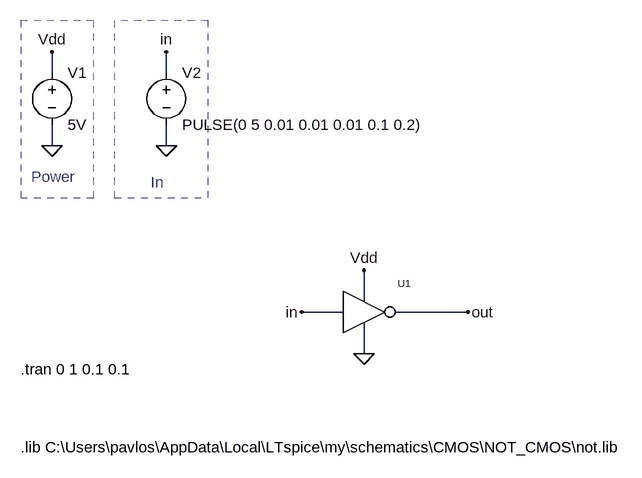
[diagram p0: schematic not_block.asc]
not_block.asc, the LTspice schematic file:
Version 4
SHEET 1 880 680
WIRE -560 -416 -560 -448
WIRE -384 -416 -384 -448
WIRE -560 -304 -560 -336
WIRE -384 -304 -384 -336
WIRE -80 -64 -80 -112
WIRE -112 -48 -176 -48
WIRE 80 -48 -32 -48
WIRE -80 16 -80 -32
FLAG 80 -48 out
FLAG -176 -48 in
FLAG -80 -112 Vdd
FLAG -80 16 0
FLAG -560 -304 0
FLAG -560 -448 Vdd
FLAG -384 -304 0
FLAG -384 -448 in
SYMBOL not -112 -16 R0
SYMATTR InstName U1
SYMBOL voltage -560 -432 R0
WINDOW 123 0 0 Left 0
WINDOW 39 0 0 Left 0
SYMATTR InstName V1
SYMATTR Value 5V
SYMBOL voltage -384 -432 R0
WINDOW 123 0 0 Left 0
WINDOW 39 0 0 Left 0
SYMATTR InstName V2
SYMATTR Value PULSE(0 5 0.01 0.01 0.01 0.1 0.2)
TEXT -592 -256 Left 2 ;Power
TEXT -408 -248 Left 2 ;In
TEXT -608 40 Left 2 !.tran 0 1 0.1 0.1
TEXT -608 160 Left 2 !.lib C:\\Users\\pavlos\\AppData\\Local\\LTspice\\my\\schematics\\CMOS\\NOT_CMOS\\not.lib
RECTANGLE Normal -496 -496 -608 -224 2
RECTANGLE Normal -320 -496 -464 -224 2

The netlist it stands for:
* not_block.asc
XU1 in out Vdd 0 not  ; pins A Y Vdd Vss
V1 Vdd 0 5V
V2 in 0 PULSE(0 5 0.01 0.01 0.01 0.1 0.2)
* Power
* In
.tran 0 1 0.1 0.1
.lib C:\Users\pavlos\AppData\Local\LTspice\my\schematics\CMOS\NOT_CMOS\not.lib
.backanno
.end

* Results of the author's LTspice run, read from the files saved beside the schematic
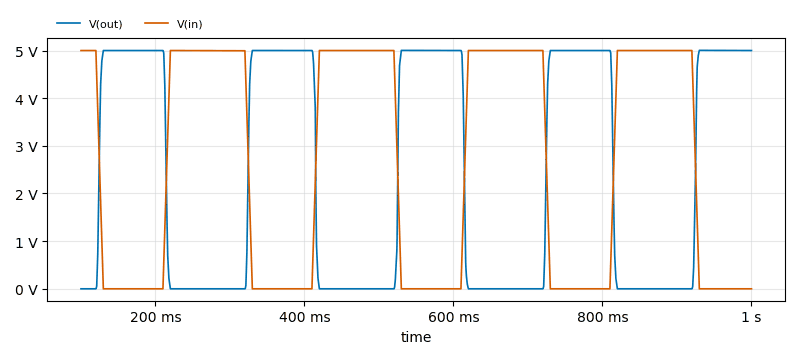
[diagram p1: Transient Analysis of not_block.asc, plotted from the saved traces]
* Transient Analysis, 1 run:
*   V(out): min 0 V, max 5.003 V, average 2.417 V, rms 3.445 V, last 5 V
*   V(in): min 0 V, max 5 V, average 2.583 V, rms 3.537 V, last 0 V